# Altium project ArtFire.PrjPcb
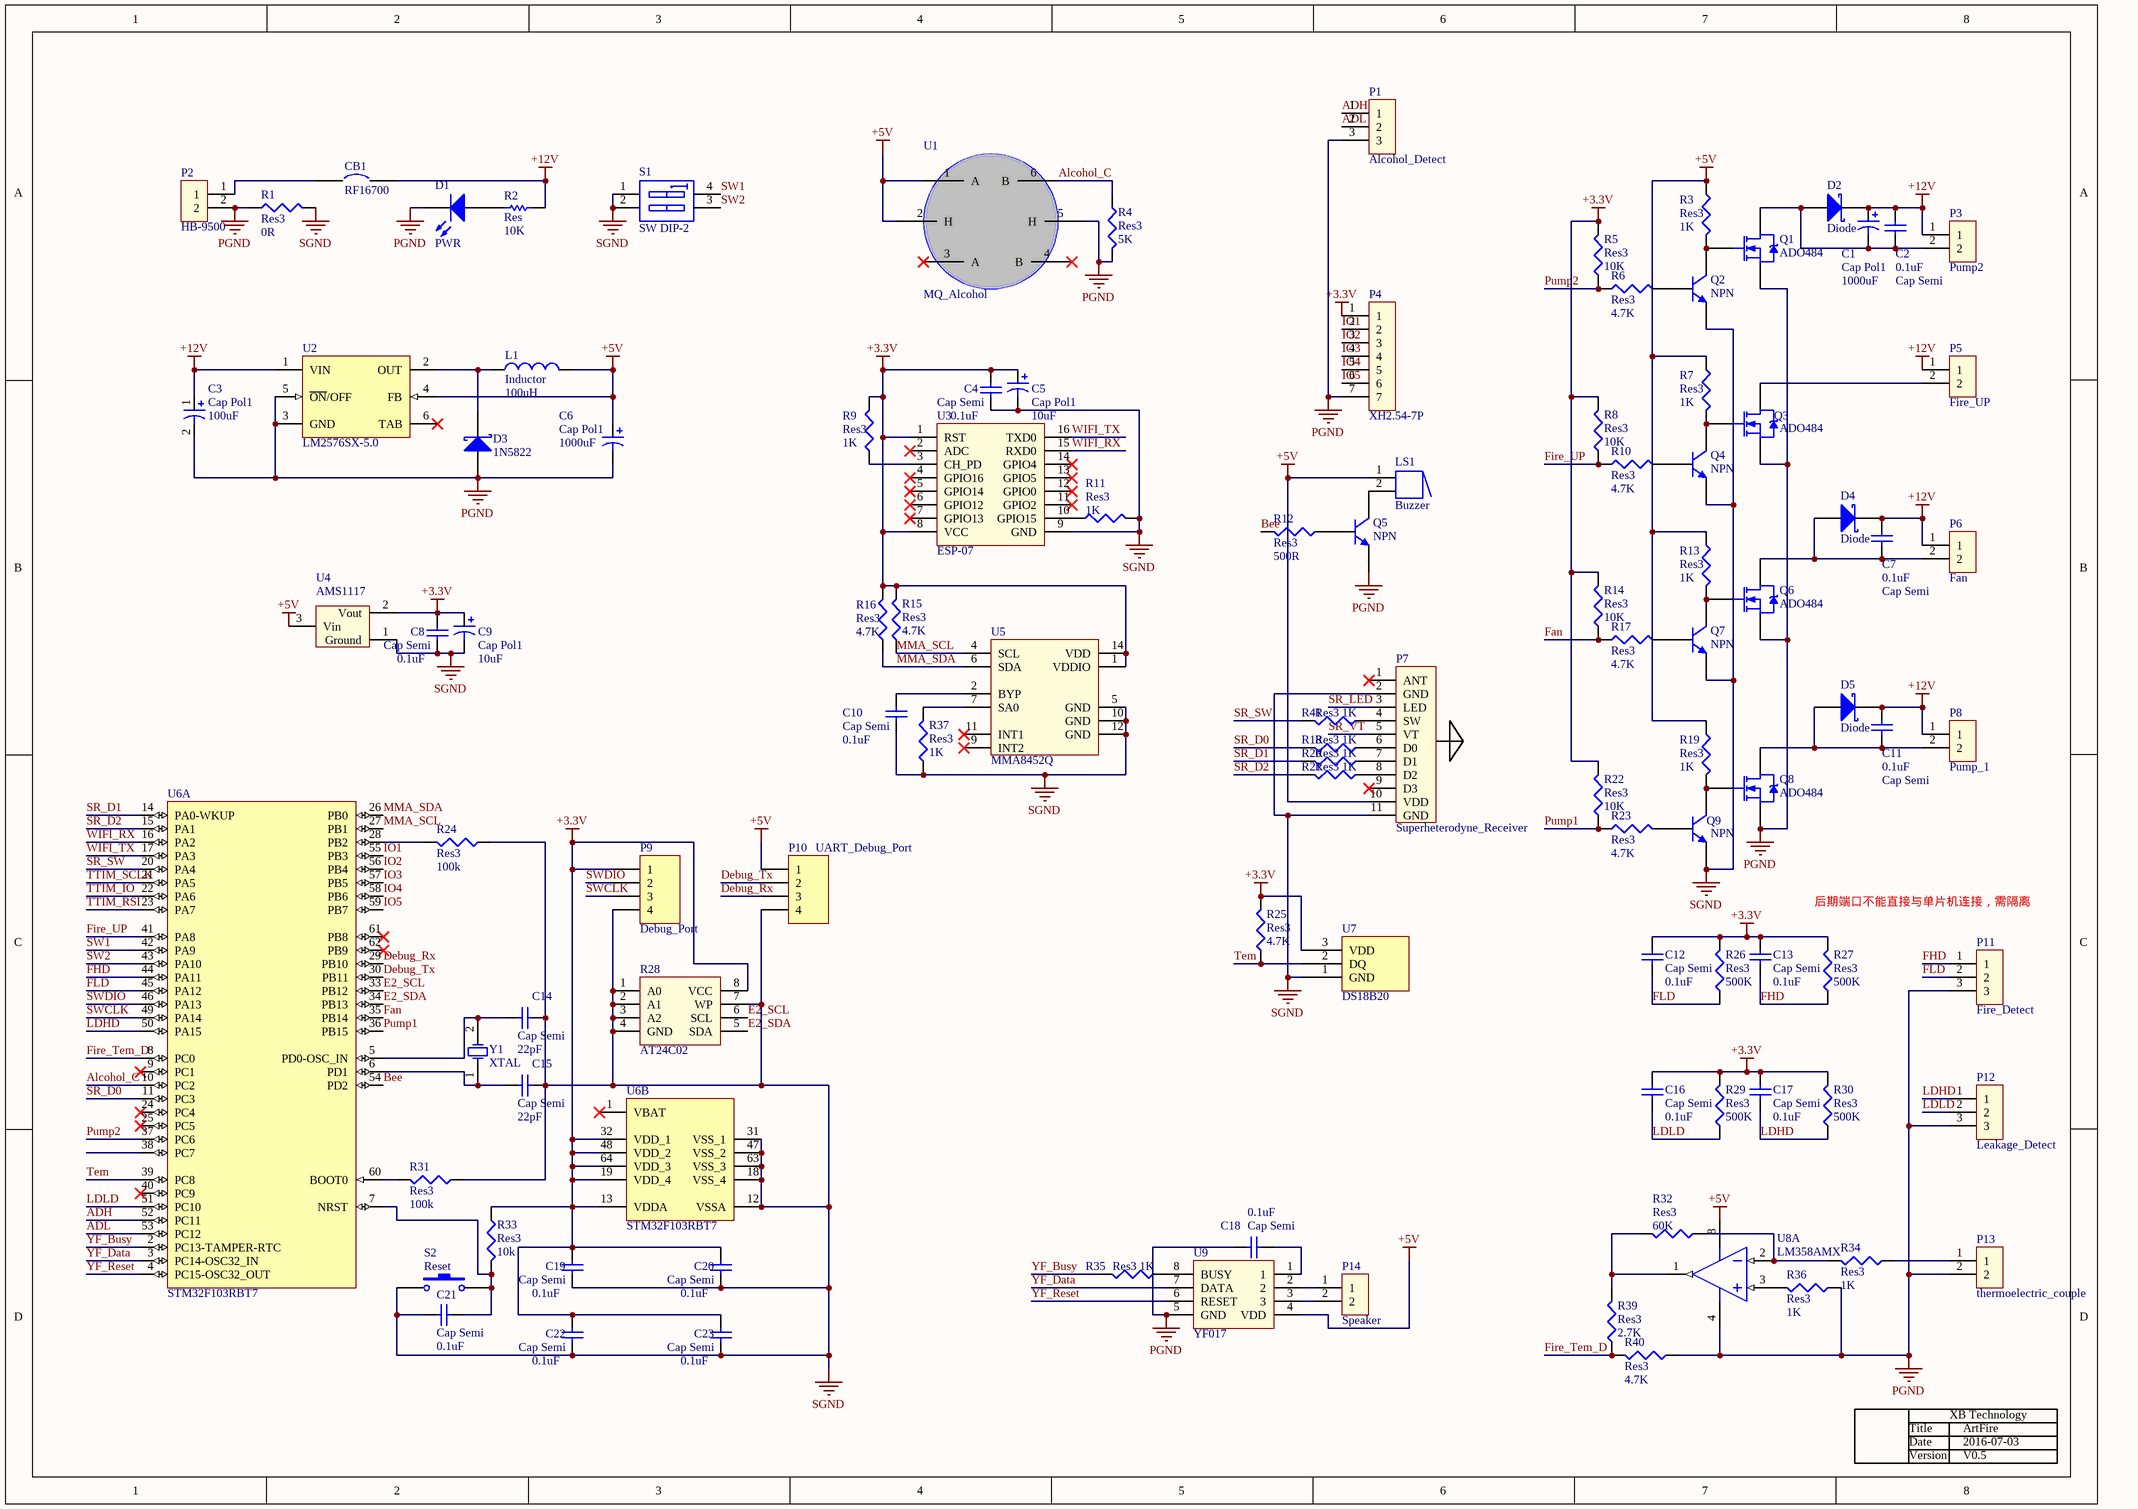
[diagram p0: ArtFire.SchDoc]
2 sheets, 112 parts. Net scope: global (net labels, ports and power ports of the same name join across sheets).
Board files: ArtFire.PcbDoc, ArtFire_Status.PcbDoc
Sheets:
  ArtFire.SchDoc
  ArtFire_Status.SchDoc

## Sheet ArtFire.SchDoc: ArtFire
size A3; Date: 2016-07-03; Version: V0.5

### Parts
C1  Cap Pol1  value 1000uF  [CAP_10*10MM]
C2  Cap Semi  value 0.1uF  [6-0805_N]
C3  Cap Pol1  value 100uF  [6032]
C4  Cap Semi  value 0.1uF  [6-0805_N]
C5  Cap Pol1  value 10uF  [Cap_5*4mm]
C6  Cap Pol1  value 1000uF  [CAP_10*10MM]
C7  Cap Semi  value 0.1uF  [6-0805_N]
C8  Cap Semi  value 0.1uF  [6-0805_N]
C9  Cap Pol1  value 10uF  [Cap_5*4mm]
C10  Cap Semi  value 0.1uF  [6-0805_N]
C11  Cap Semi  value 0.1uF  [6-0805_N]
C12  Cap Semi  value 0.1uF  [6-0805_N]
C13  Cap Semi  value 0.1uF  [6-0805_N]
C14  Cap Semi  value 22pF  [6-0805_N]
C15  Cap Semi  value 22pF  [6-0805_N]
C16  Cap Semi  value 0.1uF  [6-0805_N]
C17  Cap Semi  value 0.1uF  [6-0805_N]
C18  Cap Semi  value 0.1uF  [6-0805_N]
C19  Cap Semi  value 0.1uF  [6-0805_N]
C20  Cap Semi  value 0.1uF  [6-0805_N]
C21  Cap Semi  value 0.1uF  [6-0805_N]
C22  Cap Semi  value 0.1uF  [6-0805_N]
C23  Cap Semi  value 0.1uF  [6-0805_N]
CB1  RF16700  [SPST-2]
D1  PWR  [6-0805_N]
D2  Diode  [US1M]
D3  1N5822  [US1M]
D4  Diode  [US1M]
D5  Diode  [US1M]
L1  Inductor  value 100uH  [CDRH127]
LS1  Buzzer  [BUZZER]
P1  Alcohol_Detect  [XH2.54-3P]
P2  HB-9500  [HB-9500]
P3  Pump2  [CH3.96_2P]
P4  XH2.54-7P  [XH2.54-7P]
P5  Fire_UP  [KF3.96_2P]
P6  Fan  [XH2.54-2P]
P7  Superheterodyne_Receiver  [Sperheterodyne_Receiver]
P8  Pump_1  [CH3.96_2P]
P9  Debug_Port  [HDR1X4]
P10  UART_Debug_Port  [HDR1X4]
P11  Fire_Detect  [CH3.96_3P]
P12  Leakage_Detect  [XH2.54-3P]
P13  thermoelectric_couple  [KF7.62-2P]
P14  Speaker  [XH2.54-2P]
Q1  ADO484  [DPAK_AOD484]
Q2  NPN  [SOT-23_N]
Q3  ADO484  [DPAK_AOD484]
Q4  NPN  [SOT-23_N]
Q5  NPN  [SOT-23_N]
Q6  ADO484  [DPAK_AOD484]
Q7  NPN  [SOT-23_N]
Q8  ADO484  [DPAK_AOD484]
Q9  NPN  [SOT-23_N]
R1  Res3  value 0R  [6-0805_N]
R2  Res  value 10K  [6-0805_N]
R3  Res3  value 1K  [6-0805_N]
R4  Res3  value 5K  [6-0805_N]
R5  Res3  value 10K  [6-0805_N]
R6  Res3  value 4.7K  [6-0805_N]
R7  Res3  value 1K  [6-0805_N]
R8  Res3  value 10K  [6-0805_N]
R9  Res3  value 1K  [6-0805_N]
R10  Res3  value 4.7K  [6-0805_N]
R11  Res3  value 1K  [6-0805_N]
R12  Res3  value 500R  [6-0805_N]
R13  Res3  value 1K  [6-0805_N]
R14  Res3  value 10K  [6-0805_N]
R15  Res3  value 4.7K  [6-0805_N]
R16  Res3  value 4.7K  [6-0805_N]
R17  Res3  value 4.7K  [6-0805_N]
R18  Res3  value 1K  [6-0805_N]
R19  Res3  value 1K  [6-0805_N]
R20  Res3  value 1K  [6-0805_N]
R21  Res3  value 1K  [6-0805_N]
R22  Res3  value 10K  [6-0805_N]
R23  Res3  value 4.7K  [6-0805_N]
R24  Res3  value 100k  [6-0805_N]
R25  Res3  value 4.7K  [6-0805_N]
R26  Res3  value 500K  [6-0805_N]
R27  Res3  value 500K  [6-0805_N]
R28  AT24C02  [SOP8_TDA2822]
R29  Res3  value 500K  [6-0805_N]
R30  Res3  value 500K  [6-0805_N]
R31  Res3  value 100k  [6-0805_N]
R32  Res3  value 60K  [6-0805_N]
R33  Res3  value 10k  [6-0805_N]
R34  Res3  value 1K  [6-0805_N]
R35  Res3  value 1K  [6-0805_N]
R36  Res3  value 1K  [6-0805_N]
R37  Res3  value 1K  [6-0805_N]
R39  Res3  value 2.7K  [6-0805_N]
R40  Res3  value 4.7K  [6-0805_N]
R41  Res3  value 1K  [6-0805_N]
S1  SW DIP-2  [DIP-4]
S2  Reset  [SWP_PB_6.5mm]
U1  MQ_Alcohol  [MQ]
U2  LM2576SX-5.0  [TS5B_L]
U3  ESP-07  [ESP-07_Wifi]
U4  AMS1117  [SOT223_N]
U5  MMA8452Q  [QFN-16]
U6  STM32F103RBT7  [LQFP64_L]  (parts A,B of 2)
U7  DS18B20  [TO-92A]
U8  LM358AMX  [M08A_M]  (part A of 2)
U9  YF017  [DIP-8]
Y1  XTAL  [XTAL]

### Nets
+3.3V: C4.1 C5.1 C8.1 C9.1 C12.2 C13.2 C16.2 C17.2 C19.1 C20.1 C22.1 C23.1 P4.1 P9.1 R5.2 R8.2 R9.2 R14.2 R15.2 R16.2 R22.2 R25.2 R26.2 R27.2 R28.8(VCC) R29.2 R30.2 R33.1 U3.1(RST) U3.8(VCC) U4.2(Vout) U5.1(VDDIO) U5.14(VDD) U6.13(VDDA) U6.19(VDD_4) U6.32(VDD_1) U6.48(VDD_2) U6.64(VDD_3) U7.3(VDD)
+5V: C6.1 L1.2 LS1.1 P7.10(VDD) P10.1 R3.1 R7.1 R13.1 R19.1 U1.1(A) U1.2(H) U2.4(FB) U4.3(Vin) U8.8(V+) U9.4(VDD)
+12V: C1.1 C2.1 C3.1 C7.1 C11.1 CB1.2 D2.2(K) D4.2(K) D5.2(K) P3.1 P5.1 P6.1 P8.1 R2.2 U2.1(VIN)
PGND: C3.2 C6.2 C18.1 D1.2(K) D3.1(A) P1.3 P2.2 P4.7 P11.3 P12.3 P13.2 Q1.3(S) Q3.3(S) Q5.2(E) Q6.3(S) Q8.3(S) R1.1 R4.2 R36.1 R40.1 U1.5(H) U2.3(GND) U2.5(~{ON}/OFF) U8.4(GND) U9.5(GND)
SGND: C4.2 C5.2 C8.2 C9.2 C10.1 C14.2 C15.2 C19.2 C20.2 C21.1 C22.2 C23.2 P7.2(GND) P7.11(GND) P9.4 P10.4 Q2.2(E) Q4.2(E) Q7.2(E) Q9.2(E) R1.2 R11.2 R24.1 R28.1(A0) R28.2(A1) R28.3(A2) R28.4(GND) R28.7(WP) R31.1 R37.1 S1.1(A1) S1.2(A2) S2.1 U3.9(GND) U4.1(Ground) U5.5(GND) U5.10(GND) U5.12(GND) U6.12(VSSA) U6.18(VSS_4) U6.31(VSS_1) U6.47(VSS_2) U6.63(VSS_3) U7.1(GND)
ADH: P1.1 U6.52(PC11)
ADL: P1.2 U6.53(PC12)
Alcohol_C: R4.1 U1.6(B) U6.10(PC2)
Bee: R12.2 U6.54(PD2)
Debug_Rx: P10.3 U6.29(PB10)
Debug_Tx: P10.2 U6.30(PB11)
E2_SCL: R28.6(SCL) U6.33(PB12)
E2_SDA: R28.5(SDA) U6.34(PB13)
Fan: R14.1 R17.1 U6.35(PB14)
FHD: C13.1 P11.1 R27.1 U6.44(PA11)
Fire_Tem_D: R39.1 R40.2 U6.8(PC0)
Fire_UP: R8.1 R10.1 U6.41(PA8)
FLD: C12.1 P11.2 R26.1 U6.45(PA12)
IO1: P4.2 U6.55(PB3)
IO2: P4.3 U6.56(PB4)
IO3: P4.4 U6.57(PB5)
IO4: P4.5 U6.58(PB6)
IO5: P4.6 U6.59(PB7)
LDHD: C17.1 P12.1 R30.1 U6.50(PA15)
LDLD: C16.1 P12.2 R29.1 U6.51(PC10)
MMA_SCL: R15.1 U5.4(SCL) U6.27(PB1)
MMA_SDA: R16.1 U5.6(SDA) U6.26(PB0)
Pump1: R22.1 R23.1 U6.36(PB15)
Pump2: R5.1 R6.1 U6.37(PC6)
SR_D0: R18.2 U6.11(PC3)
SR_D1: R20.2 U6.14(PA0-WKUP)
SR_D2: R21.2 U6.15(PA1)
SR_LED: P7.3(LED)
SR_SW: R41.2 U6.20(PA4)
SR_VT: P7.5(VT)
SW1: S1.4(B1) U6.42(PA9)
SW2: S1.3(B2) U6.43(PA10)
SWCLK: P9.3 U6.49(PA14)
SWDIO: P9.2 U6.46(PA13)
Tem: R25.1 U6.39(PC8) U7.2(DQ)
TTIM_IO: U6.22(PA6)
TTIM_RSI: U6.23(PA7)
TTIM_SCLK: U6.21(PA5)
WIFI_RX: U3.15(RXD0) U6.16(PA2)
WIFI_TX: U3.16(TXD0) U6.17(PA3)
YF_Busy: R35.2 U6.2(PC13-TAMPER-RTC)
YF_Data: U6.3(PC14-OSC32_IN) U9.7(DATA)
YF_Reset: U6.4(PC15-OSC32_OUT) U9.6(RESET)
NetC1_2: C1.2 C2.2 D2.1(A) P3.2 Q1.2(D)
NetC7_2: C7.2 D4.1(A) P6.2 Q6.2(D)
NetC10_2: C10.2 U5.2(BYP)
NetC11_2: C11.2 D5.1(A) P8.2 Q8.2(D)
NetC14_1: C14.1 U6.5(PD0-OSC_IN) Y1.2(OSC2)
NetC15_1: C15.1 U6.6(PD1) Y1.1(OSC1)
NetC18_2: C18.2 U9.1
NetC21_2: C21.2 R33.2 S2.2 U6.7(NRST)
NetCB1_1: CB1.1 P2.1
NetD1_1: D1.1(A) R2.1
NetD3_2: D3.2(K) L1.1 U2.2(OUT)
NetLS1_2: LS1.2 Q5.3(C)
NetP5_2: P5.2 Q3.2(D)
NetP7_4: P7.4(SW) R41.1
NetP7_6: P7.6(D0) R18.1
NetP7_7: P7.7(D1) R20.1
NetP7_8: P7.8(D2) R21.1
NetP13_1: P13.1 R34.1
NetP14_1: P14.1 U9.2
NetP14_2: P14.2 U9.3
NetQ1_1: Q1.1(G) Q2.3(C) R3.2
NetQ2_1: Q2.1(B) R6.2
NetQ3_1: Q3.1(G) Q4.3(C) R7.2
NetQ4_1: Q4.1(B) R10.2
NetQ5_1: Q5.1(B) R12.1
NetQ6_1: Q6.1(G) Q7.3(C) R13.2
NetQ7_1: Q7.1(B) R17.2
NetQ8_1: Q8.1(G) Q9.3(C) R19.2
NetQ9_1: Q9.1(B) R23.2
NetR9_1: R9.1 U3.3(CH_PD)
NetR11_1: R11.1 U3.10(GPIO15)
NetR24_2: R24.2 U6.28(PB2)
NetR31_2: R31.2 U6.60(BOOT0)
NetR32_1: R32.1 R34.2 U8.2(INA-)
NetR32_2: R32.2 R39.2 U8.1(OUTA)
NetR35_1: R35.1 U9.8(BUSY)
NetR36_2: R36.2 U8.3(INA+)
NetR37_2: R37.2 U5.7(SA0)

Not connected (* = marked no-connect by the designer): P7 1(ANT)* 9(D3)*; U1 3(A)* 4(B)*; U2 6(TAB)*; U3 2(ADC)* 4(GPIO16)* 5(GPIO14)* 6(GPIO12)* 7(GPIO13)* 11(GPIO2)* 12(GPIO0)* 13(GPIO5)* 14(GPIO4)*; U5 3(NC) 8(NC) 9(INT2)* 11(INT1)* 13(NC) 15(NC) 16(NC); U6 1(VBAT)* 9(PC1)* 24(PC4)* 25(PC5)* 38(PC7) 40(PC9)* 61(PB8)* 62(PB9)*

### Notes on the sheet
- (near R27) 后期端口不能直接与单片机连接，需隔离
- Title
- Date
- Version
- XB Technology

### Library data of the parts
C1 C3 C5 C6 C9 = Cap Pol1: Polarized Capacitor (Radial); Published: 8-Jun-2000; LatestRevisionDate: 17-Jul-2002; LatestRevisionNote: Re-released for DXP Platform.; PackageReference: RB7.6-15; Publisher: Altium Limited; PackageDescription: Polarized Capacitor (Radial); 2 Leads
C2 C4 C7 C8 C10-C23 = Cap Semi: Capacitor (Semiconductor SIM Model); Published: 8-Jun-2000; LatestRevisionDate: 29-May-2009; LatestRevisionNote: IPC-7351 Footprint Added.; PackageReference: C1206; Publisher: Altium Limited; PackageDescription: Chip Capacitor
CB1 = Circuit Breaker: Published: 24-Mar-1999; LatestRevisionDate: 17-Jul-2002; LatestRevisionNote: Re-released for DXP Platform.; PackageReference: SPST-2; Publisher: Altium Limited; PackageDescription: Switch; 2 Leads
D1 = LED0: Typical INFRARED GaAs LED; Published: 8-Jun-2000; LatestRevisionDate: 08-Jul-2005; LatestRevisionNote: Mech Layer 1 removed.; PackageReference: LED-0; Publisher: Altium Limited; PackageDescription: LED; 2 Leads
D2-D5 = Diode BAT17: Silicon RF Schottky Diode for Mixer Applications in the VHF/UHF Range; Note: Pin 2 is not connected and not drawn.; Published: 21-Mar-2003; LatestRevisionDate: 29-May-2009; LatestRevisionNote: IPC-7351 Footprint Added.; DatasheetVersion: Oct-1999; PackageVersion: Sep-2001; PackageReference: SOT-23; Publisher: Altium Limited; PackageDescription: 3-Pin SOT-23 Package 0.95 mm Pitch, 2.5 mm Lead Span; ComponentLink1Description: Manufacturer Link; ComponentLink1URL: http://www.infineon.com/; ComponentLink2Description: Datasheet; ComponentLink2URL: http://www.infineon.com/upload/Document/cmc_upload/documents/009/363/bat17series.pdf
L1 = Inductor: Code_IEC: 1005; Published: 8-Jun-2000; LatestRevisionDate: 29-May-2009; LatestRevisionNote: IPC-7351 Footprint Added.; PackageReference: 0402-A; Publisher: Altium Limited; PackageDescription: Chip Inductor; Code_JEITA: 0402
LS1 = Buzzer: Magnetic Transducer Buzzer; Published: 24-Mar-1999; LatestRevisionDate: 17-Dec-2003; LatestRevisionNote: Schematic revised, PCB Footprint replaced.; DatasheetVersion: 17-Dec-2003; PackageReference: ABSM-1574; Publisher: Altium Limited; PackageDescription: Magnetic Transducer Buzzer; ComponentLink1Description: Manufacturer Link; ComponentLink1URL: http://www.megastar.com/linecard/buzzmode/index.php
P1 P12 = XH2.54-3P
P2 = HB-9500: High current connector
P3 P8 = CH3.96_2P
P5 P13 = KF3.96
P6 P14 = XH2.54-2P
P9 P10 = Header 4: Header, 4-Pin; LatestRevisionDate: 17-Jul-2002; LatestRevisionNote: Re-released for DXP Platform.; Publisher: Altium Limited
P11 = CH3.96_3P
Q1 Q3 Q6 Q8 = NMOS-2: N-Channel Power MOSFET; Note: Pin 2 is electrically connected to pin 4.; Published: 8-Jun-2000; LatestRevisionDate: 17-Jul-2002; LatestRevisionNote: Re-released for DXP Platform.; DatasheetVersion: PD-9.814; PackageVersion: Feb-1997; PackageReference: TO-220AB; Publisher: Altium Limited; PackageDescription: TO, Thru-Hole, Vertical, Heatsink Mounted; 3 In-Line Leads; Pitch 2.54 mm; ComponentLink1Description: Manufacturer Link; ComponentLink1URL: http://www.irf.com/
Q2 Q4 Q5 Q7 Q9 = NPN: NPN Bipolar Transistor; Published: 8-Jun-2000; LatestRevisionDate: 17-Jul-2002; LatestRevisionNote: Re-released for DXP Platform.; PackageReference: TO-226-AA; Publisher: Altium Limited; PackageDescription: TO, Flat Index; 3 In-Line, Axial Leads; Body Dia. 4.8mm; Leads 0.55 x 0.51 mm (max); Code_JEDEC: TO-226-AA
R1 R3-R27 R29-R37 R39-R41 = Res3: Resistor; Published: 8-Jun-2000; LatestRevisionDate: 29-May-2009; LatestRevisionNote: IPC-7351 Footprint Added.; PackageReference: J1-0603; Publisher: Altium Limited; PackageDescription: Chip Resistor
R2 = Res1: Resistor; Published: 8-Jun-2000; LatestRevisionDate: 17-Jul-2002; LatestRevisionNote: Re-released for DXP Platform.; PackageReference: AXIAL-0.3; Publisher: Altium Limited; PackageDescription: Axial Device, Thru-Hole; 2 Leads; 0.3 in Pin Spacing
S1 = SW DIP-2: DIP Switch, 2 Position, SPST; Published: 24-Mar-1999; LatestRevisionDate: 17-Jul-2002; LatestRevisionNote: Re-released for DXP Platform.; PackageReference: DIP-4; Publisher: Altium Limited
S2 = SW-PB: Switch; Published: 24-Mar-1999; LatestRevisionDate: 17-Jul-2002; LatestRevisionNote: Re-released for DXP Platform.; PackageReference: SPST-2; Publisher: Altium Limited; PackageDescription: Switch; 2 Leads
U1 = MQ
U2 = CMP-0069-00116-2: SIMPLE SWITCHER® 3A Step-Down Voltage Regulator, 5-pin TO-263; Manufacturer: National Semiconductor; PackageTopMarking: NSUZXYTTE#*LM2576S*-5.0 P+; PowerWise: N; ComponentLink2Description: LM2576 Web Page; Code_JEDEC: MO-169-AB; ComponentLink3Description: TS5B Package Page; PinCount: 5; RoHS: N; PackageReference: TS5B; ComponentLink1Description: LM2576 Datasheet; RevisionNote: Component URLs added; DatasheetVersion: Aug-2004; ComponentLink3URL: http://www.national.com/packaging/folders/ts5b.html; PackageVersion: revD, Apr-2005; ComponentLink2URL: http://www.national.com/pf/LM/LM2576.html; ComponentLink1URL: http://www.national.com/ds/LM/LM2576.pdf; PackageDescription: TO-263, Molded, .400 x .390 x .180in, 5 Lead, .067in Pitch, Surface Mount; CompType: Switcher
U3 = ESP-07_Wifi
U6 = CMP-0237-00161-1: STM32 ARM-based 32-bit MCU Performance Line with 128 kB Flash, 20 kB Internal RAM, -40 to +105°C Temperature, 64-Pin LQFP, Tray; ComponentLink2Description: STM32 Family Web Page; ComponentLink1URL: http://www.st.com/internet/com/TECHNICAL_RESOURCES/TECHNICAL_LITERATURE/DATASHEET/CD00161566.pdf; ComponentLink3URL: http://www.st.com/internet/com/home/home.jsp; ComponentLink1Description: STM32F103 Datasheet; PackageVersion: rev13, Apr-2011; ComponentLink2URL: www.st.com/stm32; ComponentLink3Description: st.com Home; PackageDescription: 64-Pin Low-Profile Quad Flat Pack, 10 x 10 mm Body, 0.5 mm Pitch (LQFP64); DatasheetVersion: rev13.0, Apr-2011; PackageReference: LQFP64
U8 = CMP-0055-00768-2: Low Power Dual Operational Amplifier, 8-pin Narrow SOIC; Manufacturer: National Semiconductor; PowerWise: N; PackageTopMarking: NSZXTT*LM*358AM; CompType: Amplifiers; ComponentLink2Description: LM358 Web Page; ComponentLink3Description: M08A Package Page; ComponentLink1Description: LM358 Datasheet; PackageReference: M08A; ComponentLink2URL: http://www.national.com/pf/LM/LM358.html; ComponentLink3URL: http://www.national.com/packaging/folders/m08a.html; PackageDescription: SOIC Narrow, 4.9 x 3.9 x 1.45mm, 8 Lead, 1.27mm Pitch; PinCount: 8; DatasheetVersion: Oct-2005; ComponentLink1URL: http://www.national.com/ds/LM/LM358.pdf; RevisionNote: Component URLs added; RoHS: N; Code_JEDEC: MS-012-AA; PackageVersion: revM, May-2009; Code_IPC: SOIC127P600-8
Y1 = XTAL: Crystal Oscillator; Published: 8-Jun-2000; LatestRevisionDate: 17-Jul-2002; LatestRevisionNote: Re-released for DXP Platform.; PackageReference: R38; Publisher: Altium Limited; PackageDescription: Crystal, Thru-Hole; 2 Leads; Body 3.1 x 8.2 mm (Dia.xH)

## Sheet ArtFire_Status.SchDoc
size 177 x 127 mm
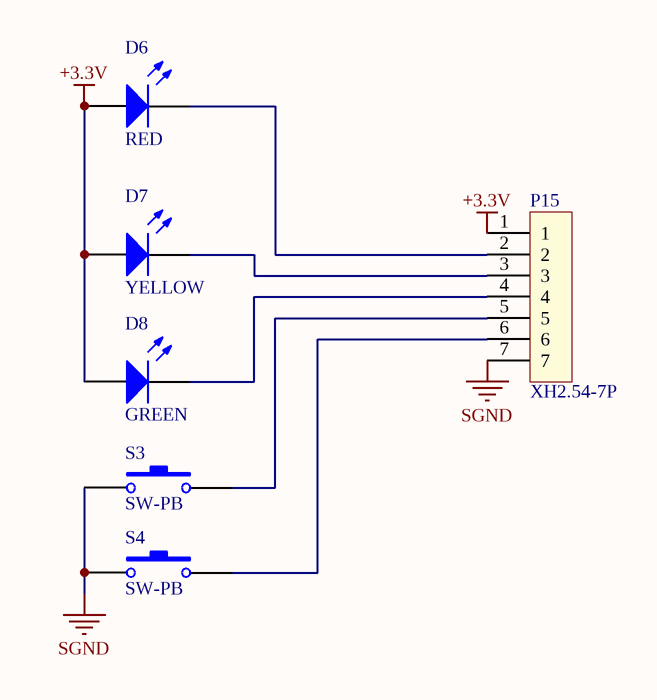
[diagram p1: ArtFire_Status.SchDoc]

### Parts
D6  RED  [LED-1]
D7  YELLOW  [LED-1]
D8  GREEN  [LED-1]
P15  XH2.54-7P  [XH2.54-7P]
S3  SW-PB  [KEY_B]
S4  SW-PB  [KEY_B]

### Nets
+3.3V: D6.1(A) D7.1(A) D8.1(A) P15.1
SGND: P15.7 S3.1 S4.1
NetD6_2: D6.2(K) P15.2
NetD7_2: D7.2(K) P15.3
NetD8_2: D8.2(K) P15.4
NetP15_5: P15.5 S3.2
NetP15_6: P15.6 S4.2

### Notes on the sheet
- Title
- Date
- Version
- XB Technology

### Library data of the parts
D6-D8 = LED1: Typical RED GaAs LED; Published: 8-Jun-2000; LatestRevisionDate: 08-Jul-2005; LatestRevisionNote: Mech Layer 1 removed.; PackageReference: LED-1; Publisher: Altium Limited; PackageDescription: LED; 2 Leads
S3 S4 = SW-PB: Switch; Published: 24-Mar-1999; LatestRevisionDate: 17-Jul-2002; LatestRevisionNote: Re-released for DXP Platform.; PackageReference: SPST-2; Publisher: Altium Limited; PackageDescription: Switch; 2 Leads

## Nets that join several sheets
+3.3V: ArtFire (39 pins), ArtFire_Status (D6.1 D7.1 D8.1 P15.1)
SGND: ArtFire (44 pins), ArtFire_Status (P15.7 S3.1 S4.1)